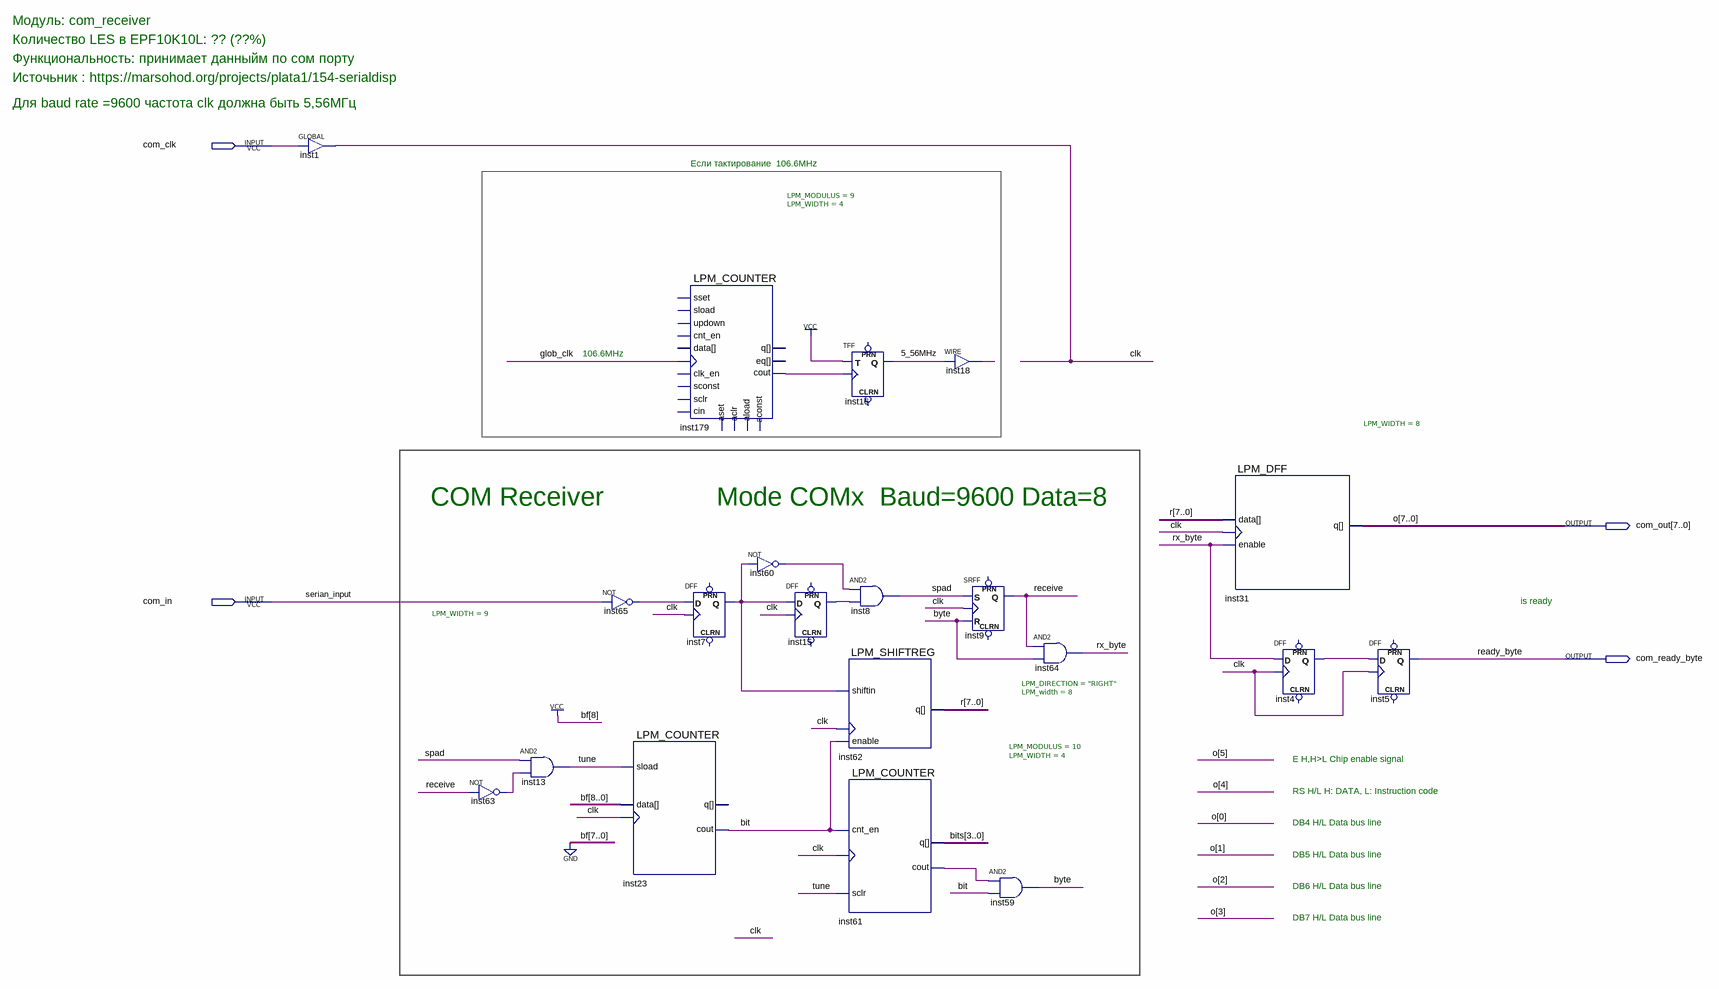
[diagram p0: schematic sheet]
// Quartus schematic sss_com_receiver.bdf as structural Verilog: 20 symbols, 4 pins
module sss_com_receiver (
  input  com_clk,
  input  com_in,
  output [7:0] com_out,
  output com_ready_byte
);

  wire \5_56MHz , \bit , \byte , clk, glob_clk, inst4_q, inst7_q, inst15_q, inst18_out, inst60_out,
       inst61_cout, inst63_out, inst65_out, inst179_cout, receive, rx_byte, spad, tune;
  wire [3:0] bits;
  wire [7:0] r;

  GLOBAL inst1 (.IN(com_clk), .OUT(clk));
  not inst63 (inst63_out, receive);
  and inst13 (tune, spad, inst63_out);
  not inst65 (inst65_out, com_in);
  LPM_COUNTER #(.LPM_WIDTH(9)) inst23 (.sload(tune), .data(9'b100000000), .clock(clk), .cout(\bit ));  // open: q
  LPM_COUNTER #(.LPM_MODULUS(9), .LPM_WIDTH(4)) inst179 (
    .clock(glob_clk), .cout(inst179_cout));  // open: sset, sload, updown, cnt_en, data, clk_en, sconst, sclr, aload, aclr, aset, aconst, cin, q, eq
  DFF inst7 (.CLK(clk), .D(inst65_out), .Q(inst7_q));  // open: CLRN, PRN
  not inst60 (inst60_out, inst7_q);
  DFF inst15 (.CLK(clk), .D(inst7_q), .Q(inst15_q));  // open: CLRN, PRN
  TFF inst16 (.T(1'b1), .CLK(inst179_cout), .Q(\5_56MHz ));  // open: PRN, CLRN
  and inst8 (spad, inst60_out, inst15_q);
  LPM_SHIFTREG #(.LPM_DIRECTION("RIGHT"), .LPM_width(8)) inst62 (.shiftin(inst7_q), .enable(\bit ), .clock(clk), .q(r));
  LPM_COUNTER #(.LPM_MODULUS(10), .LPM_WIDTH(4)) inst61 (
    .cnt_en(\bit ), .clock(clk), .sclr(tune), .q(bits), .cout(inst61_cout));
  assign inst18_out = \5_56MHz ;  // WIRE inst18
  SRFF inst9 (.S(spad), .R(\byte ), .CLK(clk), .Q(receive));  // open: PRN, CLRN
  and inst59 (\byte , inst61_cout, \bit );
  and inst64 (rx_byte, receive, \byte );
  LPM_DFF #(.LPM_WIDTH(8)) inst31 (.enable(rx_byte), .clock(clk), .data(r), .q(com_out));
  DFF inst4 (.CLK(clk), .D(rx_byte), .Q(inst4_q));  // open: CLRN, PRN
  DFF inst5 (.CLK(clk), .D(inst4_q), .Q(com_ready_byte));  // open: CLRN, PRN

  // Other names for the same wires on the sheet: o[7:0] = com_out; ready_byte = com_ready_byte; serian_input = com_in

  // Notes on the sheet:
  //   Модуль: com_receiver
  //   Количество LES в EPF10K10L: ?? (??%)
  //   Функциональность: принимает данныйм по сом порту
  //   Источьник : https://marsohod.org/projects/plata1/154-serialdisp
  //   Для baud rate =9600 частота clk должна быть 5,56МГц
  //   Если тактирование  106.6MHz
  //   106.6MHz
  //   COM Receiver               Mode COMx  Baud=9600 Data=8
  //   is ready
  //   E H,H>L Chip enable signal
  //   RS H/L H: DATA, L: Instruction code
  //   DB4 H/L Data bus line
  //   DB5 H/L Data bus line
  //   DB6 H/L Data bus line
  //   DB7 H/L Data bus line
endmodule
